# Altium schematic sheet ESC.SchDoc
size A3
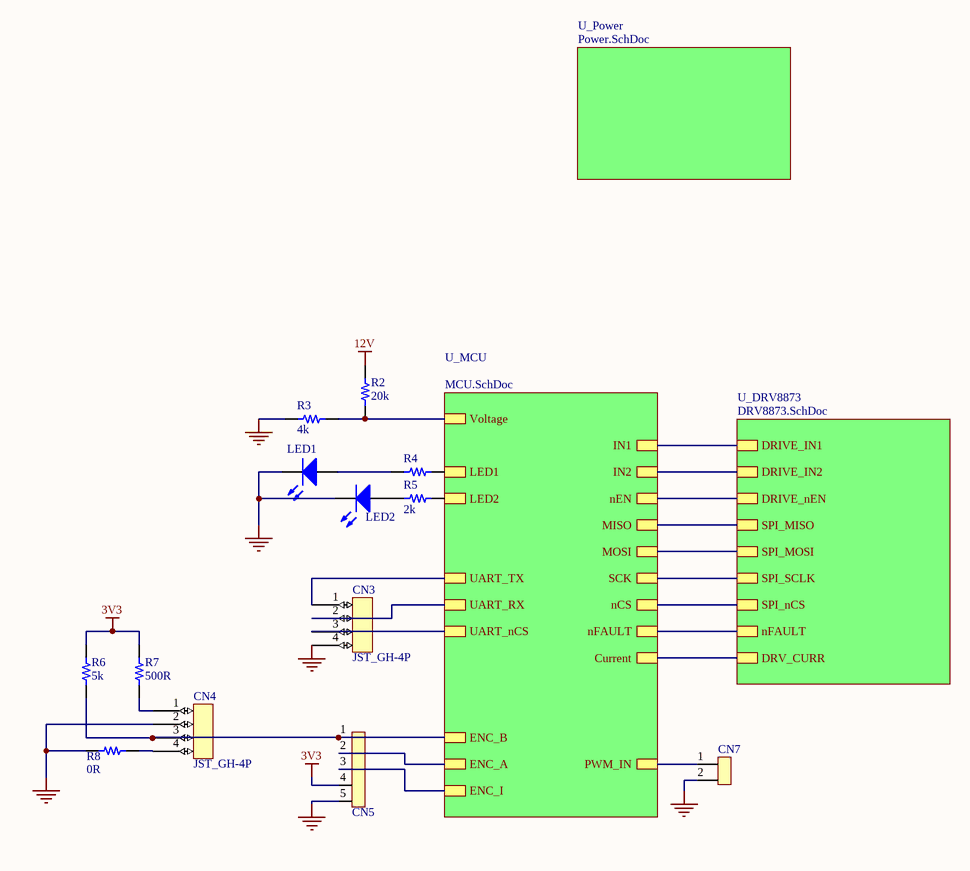
[diagram p0: ESC.SchDoc]

## Parts
CN3  JST_GH-4P  [JST_GH-4P]
CN4  JST_GH-4P  [JST_GH-4P]
CN5  5P-2.5mm  [5-Pin-Header]  (value not drawn)
CN7  2P-2.5mm  [2.5mm-2P]  (value not drawn)
LED1  LED  [0805-LED]  (value not drawn)
LED2  LED  [0805-LED]  (value not drawn)
R2  20k  [0805 - duplicate]
R3  4k  [0805 - duplicate]
R4  4k  [0805 - duplicate]  (value not drawn)
R5  2k  [0805 - duplicate]
R6  5k  [0805 - duplicate]
R7  500R  [0805 - duplicate]
R8  0R  [0805 - duplicate]

## Sub-sheets
U_DRV8873 = DRV8873.SchDoc: DRIVE_IN1, DRIVE_IN2, DRIVE_nEN, SPI_MISO, SPI_MOSI, SPI_SCLK, SPI_nCS, nFAULT, DRV_CURR
U_MCU = MCU.SchDoc: LED1, LED2, MOSI, MISO, SCK, nCS, nEN, nFAULT, IN2, IN1, Voltage, Current, UART_TX, UART_RX, UART_nCS, ENC_B, ENC_A, ENC_I, PWM_IN
U_Power = Power.SchDoc: no entries

## Nets
3V3: CN5.4 R6.1 R7.1
12V: R2.2
GND: CN3.4 CN4.2 CN5.5 CN7.2 LED1.2(K) LED2.2(K) R3.2 R8.1
NetCN3_1: CN3.1 ; sheet U_MCU/UART_TX
NetCN3_2: CN3.2 ; sheet U_MCU/UART_RX
NetCN3_3: CN3.3 ; sheet U_MCU/UART_nCS
NetCN4_1: CN4.1 R7.2
NetCN4_3: CN4.3 CN5.1 R6.2 ; sheet U_MCU/ENC_B
NetCN4_4: CN4.4 R8.2
NetCN5_2: CN5.2 ; sheet U_MCU/ENC_A
NetCN5_3: CN5.3 ; sheet U_MCU/ENC_I
NetCN7_1: CN7.1 ; sheet U_MCU/PWM_IN
NetLED1_1: LED1.1(A) R4.2
NetLED2_1: LED2.1(A) R5.2
NetR2_1: R2.1 R3.1 ; sheet U_MCU/Voltage
NetR4_1: R4.1 ; sheet U_MCU/LED1
NetR5_1: R5.1 ; sheet U_MCU/LED2
(unnamed): sheet U_MCU/MOSI, sheet U_DRV8873/SPI_MOSI
(unnamed): sheet U_MCU/MISO, sheet U_DRV8873/SPI_MISO
(unnamed): sheet U_MCU/SCK, sheet U_DRV8873/SPI_SCLK
(unnamed): sheet U_MCU/nCS, sheet U_DRV8873/SPI_nCS
(unnamed): sheet U_MCU/nEN, sheet U_DRV8873/DRIVE_nEN
(unnamed): sheet U_MCU/nFAULT, sheet U_DRV8873/nFAULT
(unnamed): sheet U_MCU/IN2, sheet U_DRV8873/DRIVE_IN2
(unnamed): sheet U_MCU/IN1, sheet U_DRV8873/DRIVE_IN1
(unnamed): sheet U_MCU/Current, sheet U_DRV8873/DRV_CURR

## Library data of the parts
R2-R8 = Resistor